# EAGLE design IN196CurrentSenseV2 (EAGLE 6.4)
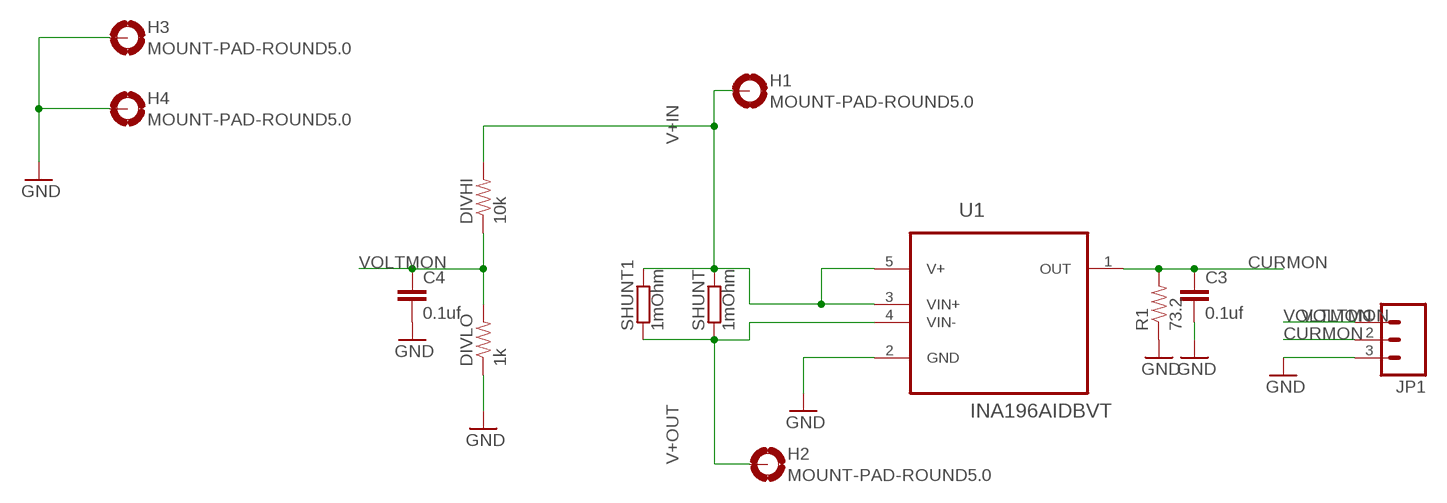
[diagram p0: schematic, sheet 1]

## Parts
C3  0.1uf  CAP0603-CAP  [0603-CAP]
C4  0.1uf  CAP0603-CAP  [0603-CAP]
DIVHI  10k  RESISTOR0603  [0603-RES]
DIVLO  1k  RESISTOR0603  [0603-RES]
H1  MOUNT-PAD-ROUND5.0  [5,0-PAD]
H2  MOUNT-PAD-ROUND5.0  [5,0-PAD]
H3  MOUNT-PAD-ROUND5.0  [5,0-PAD]
H4  MOUNT-PAD-ROUND5.0  [5,0-PAD]
JP1  M03LONGPADS  [1X03_LONGPADS]
R1  73.2  RESISTOR0603-RES  [0603-RES]
SHUNT  1mOhm  SMS-0  [SMS-0]
SHUNT1  1mOhm  SMS-0  [SMS-0]
U1  INA196AIDBVT  [SOT95P280X145-5N]

## Nets
CURMON: C3.1 JP1.2 R1.2 U1.1(OUT)
GND: C3.2 C4.2 DIVLO.1 H3.B5(MOUNT) H4.B5(MOUNT) JP1.3 R1.1 U1.2(GND)
V+IN: DIVHI.2 H1.B5(MOUNT) SHUNT1.1 SHUNT.1 U1.3(VIN+) U1.5(V+)
V+OUT: H2.B5(MOUNT) SHUNT1.2 SHUNT.2 U1.4(VIN-)
VOLTMON: C4.1 DIVHI.1 DIVLO.2 JP1.1

## Library data of the parts
C3 C4 = SparkFun-Capacitors:CAP: Capacitor Standard 0603 ceramic capacitor, and 0.1" leaded capacitor.
DIVHI DIVLO = SparkFun-Resistors:RESISTOR: Resistor Basic schematic elements and footprints for 0603, 1206, and PTH resistors.
H1-H4 = holes:MOUNT-PAD-ROUND: MOUNTING PAD, round
JP1 = SparkFun-Connectors:M03: Header 3 Standard 3-pin 0.1" header. Use with straight break away headers (SKU : PRT-00116), right angle break away headers (PRT-00553), swiss pins (PRT-00743), machine pins (PRT-00117), and female headers (PRT-00115). Molex polarized connector foot print use with SKU : PRT-08232 with associated crimp pins and housings.
R1 = SparkFun-Passives:RESISTOR: Resistor Basic schematic elements and footprints for 0603, 1206, and PTH resistors.
SHUNT SHUNT1 = resistor-shunt:SMS-0: SMD SHUNT RESISTOR; OC_FARNELL: unknown; OC_NEWARK: unknown
U1 = INA196:INA196AIDBVT: CURRENT SHUNT MONITOR -16V to +80V Common-Mode Range; MPN: INA196AIDBVT; OC_FARNELL: 1564942; OC_NEWARK: 21J8786; PACKAGE: SOT-23-5; SUPPLIER: Texas Instruments

## Board
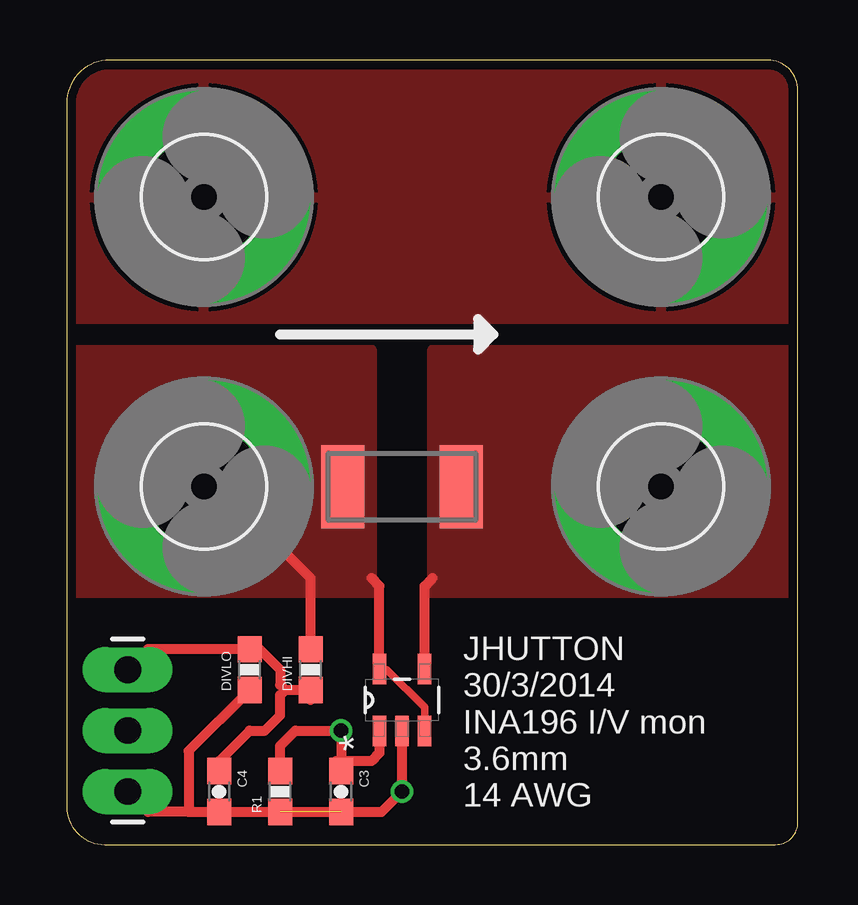
[diagram p1: board, top side]
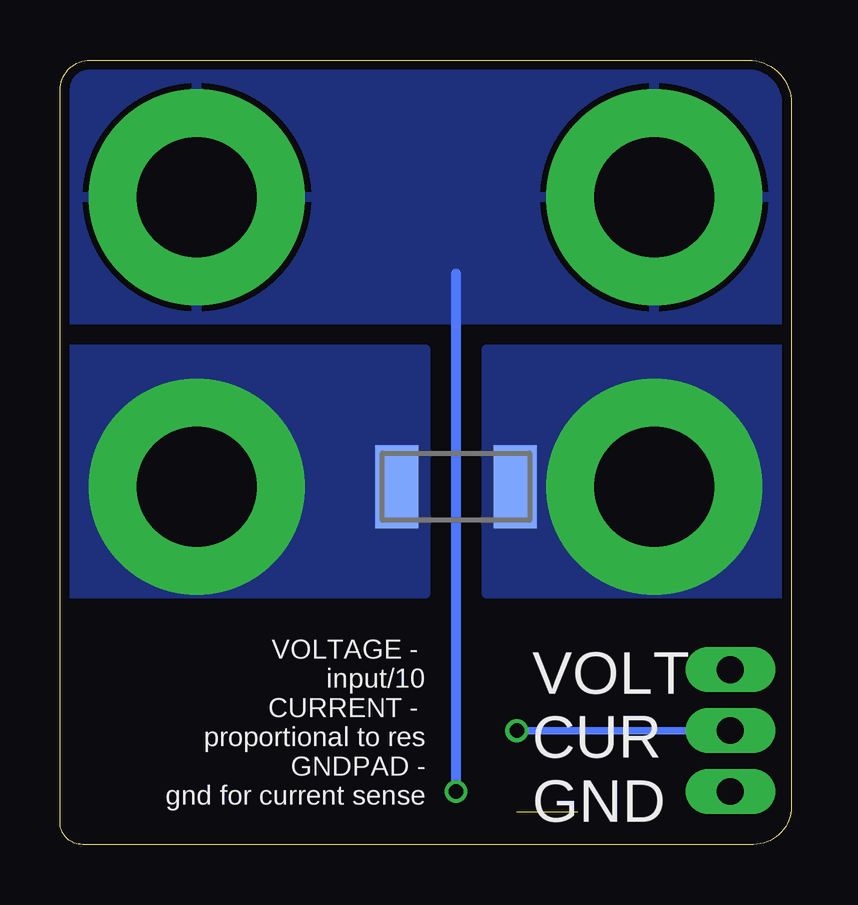
[diagram p2: board, bottom side, seen from below]

Size 30.47 x 32.69 mm. Coordinates in mm from the lower left corner, seen from the top.
Outline: 29.21,32.69 1.8,32.69 arc90 0,30.89 0,1.58 arc90 1.58,0 29.53,0 arc90 30.47,0.94 30.47,31.43 arc90 29.21,32.69
Copper layers (1*16): Top 0.0356mm / dielectric 1.5011mm / Bottom 0.0356mm
Design rules "LaenPCBOrder": minimum track width 6mil, minimum drill 13mil, track to track 6mil, track to pad 6mil, pad to pad 6mil, via to via 6mil, smd to smd 6mil, copper to edge 15mil, drill to drill 6mil, minimum pad ring 7mil, minimum via ring 7mil, stop-mask expansion 3mil, vias tented up to drill 0mil, thermal gap 10mil

### Footprints (pad centres in the part's own frame; a part is rotated, then mirrored left to right if it is on the bottom)
0603-CAP = smd 1.1 x 1: 1 -0.85,0; 2 0.85,0
0603-RES = smd 1.1 x 1: 1 -0.85,0; 2 0.85,0
5,0-PAD = drill 5 pad 9: B5 0,0
1X03_LONGPADS = drill 1.118 pad 1.88 long: 1 0,0; 2 2.54,0; 3 5.08,0
SMS-0 = smd 1.8 x 3.45: 1 2.464,0; 2 -2.464,0
SOT95P280X145-5N = smd 1.27 x 0.559: 1 -1.295,0.94; 2 -1.295,0; 3 -1.295,-0.94; 4 1.295,-0.94; 5 1.295,0.94

### Placement (x,y rotation side)
C3  11.43,2.21 270 top
C4  6.35,2.21 270 top
DIVHI  10.16,7.29 90 top
DIVLO  7.62,7.29 90 top
H1  5.71,14.91 270 top
H2  24.77,14.91 270 top
H3  5.71,26.98 0 top
H4  24.77,26.98 0 top
JP1  2.54,7.29 270 top
R1  8.89,2.21 90 top
SHUNT  13.97,14.91 180 top
SHUNT1  13.97,14.91 0 bottom
U1  13.97,6.02 90 top

### Tracks (layer width: path | path; a pad name or v marks a point on that pad's centre or on a via)
CURMON  (via drill 0.6)
  Top 0.406: U1.1 13.03,3.81 12.7,3.48 11.21,3.48 C3.1 v11.43,4.75 9.53,4.75 8.89,4.12 R1.2
  Bottom 0.305: v11.43,4.75 JP1.2
GND  (via drill 0.6)  (1 unrouted)
  Top 0.406: 5.08,1.36 3.39,1.36 JP1.3 | 5.08,1.36 5.08,3.9 DIVLO.1 | 5.08,1.36 C4.2 C3.2 13.12,1.36 v13.97,2.21 U1.2
  Bottom 0.406: v13.97,2.21 13.97,23.8
  pour Bottom (isolate 0.305): 0,32.69 30.48,32.69 30.48,21.9 0,21.9
  pour Top (isolate 0.305): 0,32.69 30.48,32.69 30.48,21.9 0,21.9
  pour Bottom: 0,32.69 30.48,32.69 30.48,22.53 0,22.53
V+IN
  Top 0.305: U1.3 14.91,5.71 13.34,7.29 13.06,7.29 U1.5
  Top 0.406: U1.5 13.03,10.77 12.7,11.1 | 8.89,12.37 10.16,11.1 DIVHI.2
  pour Top (isolate 0.305, no thermals): 0,20.62 12.7,20.62 12.7,10.46 0,10.46
  pour Bottom (isolate 0.305, no thermals): 0,20.62 12.7,20.62 12.7,10.46 0,10.46
V+OUT
  Top 0.406: U1.4 14.91,10.77 15.24,11.1
  pour Top (isolate 0.305, no thermals): 15.24,20.62 30.48,20.62 30.48,10.46 15.24,10.46
  pour Bottom (isolate 0.305, no thermals): 15.24,20.62 30.48,20.62 30.48,10.46 15.24,10.46
VOLTMON
  Top 0.406: 2.75,7.5 JP1.1 3.39,8.14 DIVLO.2 8.04,8.14 8.89,7.29 8.89,6.66 9.11,6.44 | 10.16,6.02 DIVHI.1 9.11,6.44 | C4.1 6.35,3.48 7.62,4.75 8.26,4.75 8.89,5.38 8.89,6.22 9.11,6.44

### Text on the board
tNames: JHUTTON / 30/3/2014 / INA196 I/V mon / 3.6mm / 14 AWG
bNames: VOLTAGE - / input/10 / CURRENT - / proportional to res / GNDPAD - / gnd for current sense | VOLT / CUR / GND